# Altium schematic sheet RS232 MAX3222EEWN.SchDoc
size 90 x 90 mm
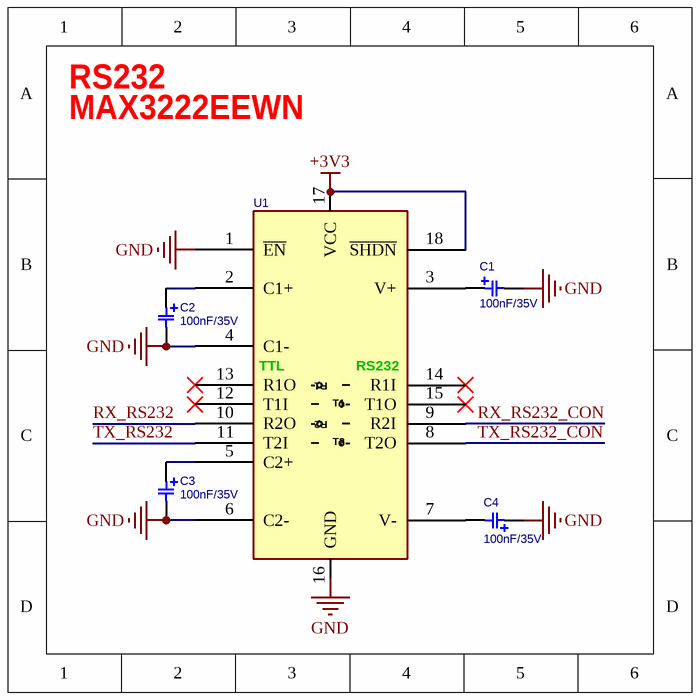
[diagram p0: RS232 MAX3222EEWN.SchDoc]

## Parts
C1  100nF/35V  [C_TN_A]
C2  100nF/35V  [C_TN_A]
C3  100nF/35V  [C_TN_A]
C4  100nF/35V  [C_TN_A]
U1  (no value)  [SO_18]

## Nets
+3V3: U1.17(VCC) U1.18(~{SHDN})
GND: C1.2 C2.2 C3.2 C4.1 U1.1(~{EN}) U1.4(C1-) U1.6(C2-) U1.16(GND)
RX_RS232: U1.10(R2O)
RX_RS232_CON: U1.9(R2I)
TX_RS232: U1.11(T2I)
TX_RS232_CON: U1.8(T2O)
NetC1_1: C1.1 U1.3(V+)
NetC2_1: C2.1 U1.2(C1+)
NetC3_1: C3.1 U1.5(C2+)
NetC4_2: C4.2 U1.7(V-)

Not connected (* = marked no-connect by the designer): U1 12(T1I)* 13(R1O)* 14(R1I)* 15(T1O)*

## Notes on the sheet
- MAX3222EEWN
- RS232
- (in symbol RS232_MAX3222_SOP18W) TTL; RS232; R1; T1; R2; T2

## Library data of the parts
C1-C4 = CAP_SMD_TAN: CAP, SMD, TAN; PARAM: 35V; VALUE: 100nF/35V
U1 = RS232_MAX3222_SOP18W: RS-232, DUAL, +3~5V, Driver/Receiver, Low-Power, up to 1Mbps, Using Four 0.1µF External Capacitor; MANF_PART#: MAX3232ECWE+; MANF: Maxim Integrated; PARAM2: +3~5.5V; PARAM: PARAM